# Altium schematic sheet inputs.SchDoc
size B; SheetNumber: 2; SheetTotal: 3
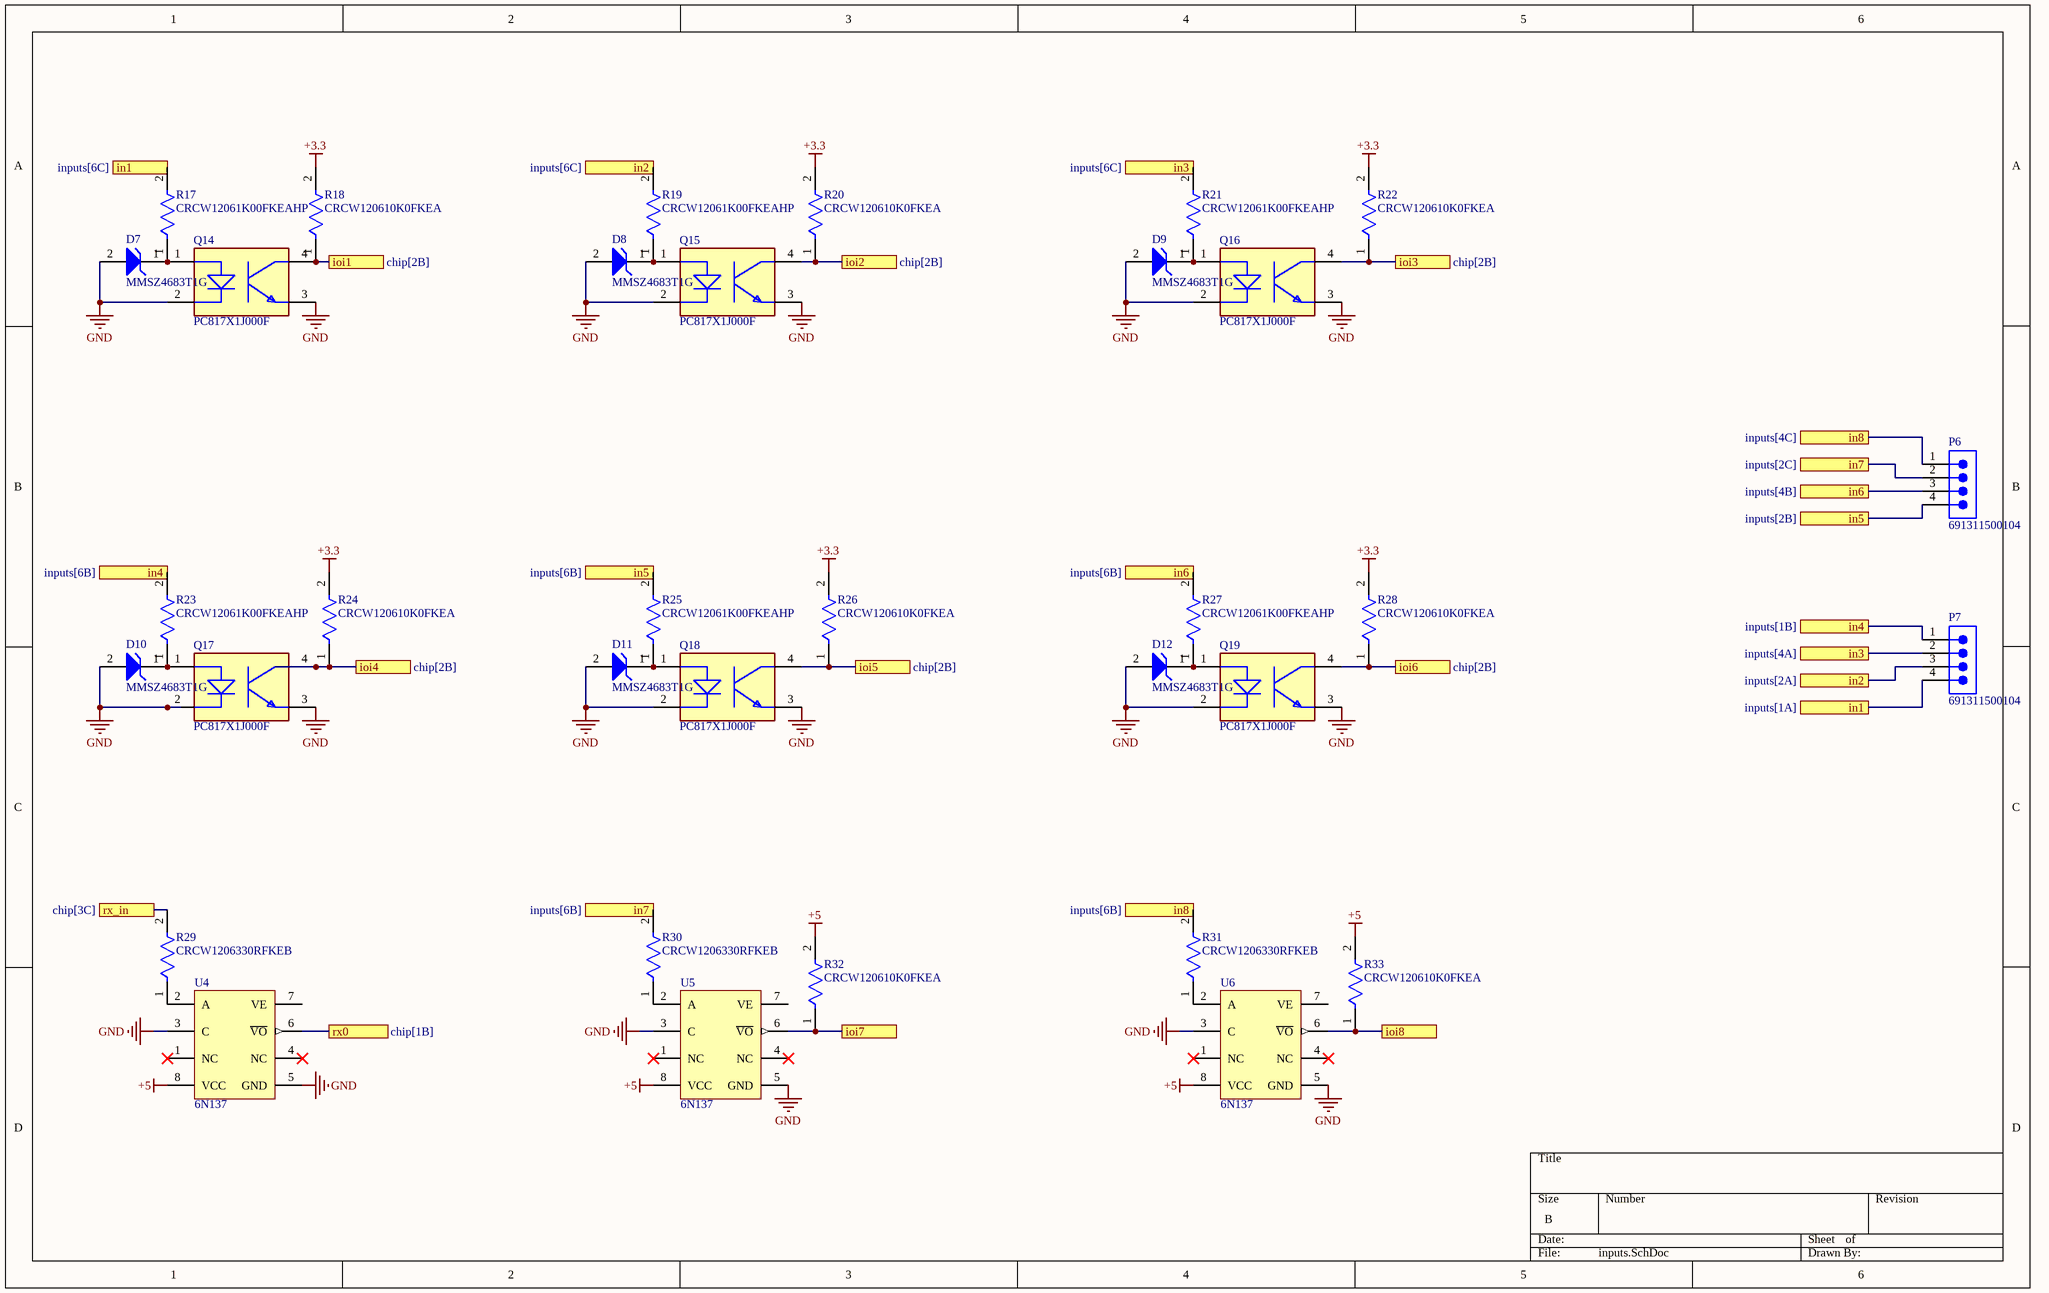
[diagram p0: inputs.SchDoc]

## Parts
D7  MMSZ4683T1G  [ONSC-SOD-123-2-425-04_V]
D8  MMSZ4683T1G  [ONSC-SOD-123-2-425-04_V]
D9  MMSZ4683T1G  [ONSC-SOD-123-2-425-04_V]
D10  MMSZ4683T1G  [ONSC-SOD-123-2-425-04_V]
D11  MMSZ4683T1G  [ONSC-SOD-123-2-425-04_V]
D12  MMSZ4683T1G  [ONSC-SOD-123-2-425-04_V]
P6  691311500104  [691311500104]
P7  691311500104  [691311500104]
Q14  PC817X1J000F  [FP-PC817X1J000F-MFG]
Q15  PC817X1J000F  [FP-PC817X1J000F-MFG]
Q16  PC817X1J000F  [FP-PC817X1J000F-MFG]
Q17  PC817X1J000F  [FP-PC817X1J000F-MFG]
Q18  PC817X1J000F  [FP-PC817X1J000F-MFG]
Q19  PC817X1J000F  [FP-PC817X1J000F-MFG]
R17  CRCW12061K00FKEAHP  [FP-CRCW1206-HPe3-MFG]
R18  CRCW120610K0FKEA  [FP-CRCW1206-e3-IPC_C]
R19  CRCW12061K00FKEAHP  [FP-CRCW1206-HPe3-MFG]
R20  CRCW120610K0FKEA  [FP-CRCW1206-e3-IPC_C]
R21  CRCW12061K00FKEAHP  [FP-CRCW1206-HPe3-MFG]
R22  CRCW120610K0FKEA  [FP-CRCW1206-e3-IPC_C]
R23  CRCW12061K00FKEAHP  [FP-CRCW1206-HPe3-MFG]
R24  CRCW120610K0FKEA  [FP-CRCW1206-e3-IPC_C]
R25  CRCW12061K00FKEAHP  [FP-CRCW1206-HPe3-MFG]
R26  CRCW120610K0FKEA  [FP-CRCW1206-e3-IPC_C]
R27  CRCW12061K00FKEAHP  [FP-CRCW1206-HPe3-MFG]
R28  CRCW120610K0FKEA  [FP-CRCW1206-e3-IPC_C]
R29  CRCW1206330RFKEB  [FP-CRCW1206-e3-IPC_A]
R30  CRCW1206330RFKEB  [FP-CRCW1206-e3-IPC_A]
R31  CRCW1206330RFKEB  [FP-CRCW1206-e3-IPC_A]
R32  CRCW120610K0FKEA  [FP-CRCW1206-e3-IPC_C]
R33  CRCW120610K0FKEA  [FP-CRCW1206-e3-IPC_C]
U4  6N137  [VISH-DIP-8_A]
U5  6N137  [VISH-DIP-8_A]
U6  6N137  [VISH-DIP-8_A]

## Ports
in1 (see inputs[1A]), in1 (see inputs[6C]), in2 (see inputs[2A]), in2 (see inputs[6C]), in3 (see inputs[4A]), in3 (see inputs[6C]), in4 (see inputs[1B]), in4 (see inputs[6B]), in5 (see inputs[2B]), in5 (see inputs[6B]), in6 (see inputs[4B]), in6 (see inputs[6B]), in7 (see inputs[2C]), in7 (see inputs[6B]), in8 (see inputs[4C]), in8 (see inputs[6B]), ioi1 (see chip[2B]), ioi2 (see chip[2B]), ioi3 (see chip[2B]), ioi4 (see chip[2B]), ioi5 (see chip[2B]), ioi6 (see chip[2B]), ioi7, ioi8, rx0 (see chip[1B]), rx_in (see chip[3C])

## Nets
+3.3: R18.2 R20.2 R22.2 R24.2 R26.2 R28.2
+5: R32.2 R33.2 U4.8(VCC) U5.8(VCC) U6.8(VCC)
GND: D7.2(A) D8.2(A) D9.2(A) D10.2(A) D11.2(A) D12.2(A) Q14.2(C) Q14.3(E) Q15.2(C) Q15.3(E) Q16.2(C) Q16.3(E) Q17.2(C) Q17.3(E) Q18.2(C) Q18.3(E) Q19.2(C) Q19.3(E) U4.3(C) U4.5(GND) U5.3(C) U5.5(GND) U6.3(C) U6.5(GND)
in1: P7.4 R17.2 ; port in1
in2: P7.3 R19.2 ; port in2
in3: P7.2 R21.2 ; port in3
in4: P7.1 R23.2 ; port in4
in5: P6.4 R25.2 ; port in5
in6: P6.3 R27.2 ; port in6
in7: P6.2 R30.2 ; port in7
in8: P6.1 R31.2 ; port in8
ioi1: Q14.4(C) R18.1 ; port ioi1
ioi2: Q15.4(C) R20.1 ; port ioi2
ioi3: Q16.4(C) R22.1 ; port ioi3
ioi4: Q17.4(C) R24.1 ; port ioi4
ioi5: Q18.4(C) R26.1 ; port ioi5
ioi6: Q19.4(C) R28.1 ; port ioi6
ioi7: R32.1 U5.6(~{VO}) ; port ioi7
ioi8: R33.1 U6.6(~{VO}) ; port ioi8
rx0: U4.6(~{VO}) ; port rx0
rx_in: R29.2 ; port rx_in
NetD7_1: D7.1(K) Q14.1(A) R17.1
NetD8_1: D8.1(K) Q15.1(A) R19.1
NetD9_1: D9.1(K) Q16.1(A) R21.1
NetD10_1: D10.1(K) Q17.1(A) R23.1
NetD11_1: D11.1(K) Q18.1(A) R25.1
NetD12_1: D12.1(K) Q19.1(A) R27.1
NetR29_1: R29.1 U4.2(A)
NetR30_1: R30.1 U5.2(A)
NetR31_1: R31.1 U6.2(A)

Not connected (* = marked no-connect by the designer): U4 1(NC)* 4(NC)* 7(VE); U5 1(NC)* 4(NC)* 7(VE); U6 1(NC)* 4(NC)* 7(VE)

## Library data of the parts
D7-D12 = CMP-1060-00600-1: Zener Voltage Regulator, 500 mW, 2-Pin SOD-123, Pb-Free, Tape and Reel; Manufacturer: On Semiconductor; P Max (W): 0.5; VZ Typ (V): 3; ComponentLink2Description: Datasheet; ComponentLink3URL: http://www.onsemi.com/pub_link/Collateral/425-04.PDF; PackageVersion: Rev. G, 10/2009; RoHS: Pb-Free; ComponentLink2URL: http://www.onsemi.com/pub_link/Collateral/MMSZ4678T1-D.PDF; DatasheetVersion: Rev. 9; PackageDescription: 2-Pin SOD, Body 1.6 x 2.69 mm; PartNumber: MMSZ4683T1G; ComponentLink3Description: Package Specification; ComponentLink1URL: http://www.onsemi.com/; ComponentLink1Description: Manufacturer URL; Packing: Tape and Reel; PackageReference: SOD-123-2-425-04; Mounting Technology: Surface Mount
P6 P7 = CMP-1502-02148-2: NexarPartId: 8917749; Pitch: 5.08mm; Number of Positions Per Level: 4; Gender: Male; Voltage: 300V; Current: 20A; Number of Levels: 1; Orientation: Vertical; Number of Pins: 4; Mount: Through Hole; Number of Contacts: 4; Length: 8.5mm; Number of Rows: 1; Contact Plating: Tin; Color: Green; Termination: Solder; Contact Material: Brass; REACH SVHC: Unknown; RoHS: Compliant; Lead Pitch: 5.08mm; Width: 22.32mm; Height: 12mm; Packaging: Box
Q14-Q19 = CMP-65434-000003-1: OPTOISOLATOR 5KV TRANS 4DIP; Collector Emitter Saturation Voltage: 200mV; Forward Voltage: 1.4V; Power Dissipation: 200mW; Input Current: 20mA; Max Collector Current: 50mA; Collector Emitter Breakdown Voltage: 80V; Rise Time: 18000ns; Number of Elements: 1; Reverse Breakdown Voltage: 6V; Current Transfer Ratio: 600%; Min Operating Temperature: -30°C; Number of Pins: 4; Radiation Hardening: No; Output Current per Channel: 50mA; Case/Package: DIP; Fall Time: 18000ns; Forward Current: 50mA; Isolation Voltage: 5kV; Package Quantity: 2000; Max Operating Temperature: 100°C; Packaging: Sleeve; Max Input Current: 50mA; Output Voltage: 80V; Max Power Dissipation: 200mW; Mount: Through Hole; Number of Channels: 1; Collector Emitter Voltage (VCEO): 80V
R17 R19 R21 R23 R25 R27 = CMP-2003-04874-2: RES SMD 1K OHM 1% 3/4W 1206; Manufacturer: Vishay; Automotive Grade: Grade 0; Resistance: 1kΩ; Power Rating: 0.75W; Temperature Coefficient: 100ppm/°C; Value: 1kΩ; Voltage Rating: 200V; Category: Res; Tolerance: 1%; Manufacturer Part Number: CRCW12061K00FKEAHP; Mouser Description: Res Thick Film 1206 1K Ohm 1% 0.75W ±100ppm/°C Molded SMD SMD Paper T/R; Octopart: https://octopart.com/crcw12061k00fkeahp-vishay-42635114; Package: CRCW1206-HPe3; Device Class L1: Passive Components; Ipc Land Pattern Name: RESC310160X50; Temperature Range High: +155°C; Lead Free: Yes; Device Class L2: Resistors; RoHS: TRUE; Temperature: -55°C to +155°C; Composition: Thick Film; Height: 0.65mm; Automotive: Yes; ComponentLink2Description: Datasheet; Digikey Description: RES SMD 1K OHM 1% 3/4W 1206; ComponentLink2URL: http://www.vishay.com/docs/20043/crcwhpe3.pdf; Device Class L3: Chip SMD Resistors; Series: CRCW-HP e3; Temperature Range Low: -55°C
R18 R20 R22 R24 R26 R28 R32 R33 = CMP-2003-04807-2: RES Thick Film, 10kΩ, 1%, 0.25W, 100ppm/°C, 1206; Working Voltage: 200V; Max Power Dissipation: 250mW; Resistance: 10kR; Tolerance: 1%; Width: 0.063inch; Height: 0.55mm; Number of Pins: 2; Voltage Rating: 200V; Temperature Coefficient: 100ppm/°C; Military Standard: Not; Features: Automotive AEC-Q200; Depth: 1.6mm; Radiation Hardening: No; Termination: SMD/SMT; Case Code (Imperial): 1206; Weight: 0.000353oz; Length: 3.2mm; Package Quantity: 10; Voltage Rating (DC): 200V; Case/Package: 1206; Min Operating Temperature: -55°C; Number of Terminations: 2; Composition: Thick Film; Contact Plating: Tin; Power Rating: 250mW; Packaging: Tape and Reel; Max Operating Temperature: 155°C; Lead Free: Lead Free; Case Code (Metric): 3216
R29-R31 = CMP-02407-010853-1: RES Thick Film, 330Ω, 1%, 0.25W, 100ppm/°C, 1206; Resistance: 330R; Power Rating: 250mW; Voltage Rating: 200V; Package Quantity: 10000; Width: 0.063inch; Length: 0.126inch; Case/Package: 1206; Lead Free: Lead Free; Max Operating Temperature: 155°C; Height: 0.024inch; Case Code (Imperial): 1206; Weight: 0.000353oz; Max Power Dissipation: 250mW; Packaging: Tape and Reel; Case Code (Metric): 3216; Number of Terminations: 2; Min Operating Temperature: -55°C; Features: Automotive AEC-Q200; Tolerance: 1%; Composition: Thick Film; Temperature Coefficient: 100ppm/°C
U4-U6 = CMP-2000-05669-1: High Speed Optocoupler, Single and Dual, 10 MBd, 5 V, -40 to 100 degC, 8-Pin DIP, RoHS, Tube; Manufacturer: Vishay; No. of Channels: 1Channel; Isolation Voltage: 5.3kV; Data Rate: 10Mbaud; SVHC: ToBeAdvised; No. of Pins: 8Pins; Package Description: 8-Pin Double In-line Package, Body 10.16 x 6.7 mm, Pitch 2.54 mm; Manufacturer URL: http://www.vishay.com/; Product Range: -; Optocoupler Case Style: DIP; Mounting Technology: ThroughHole; Packaging: Each; Package Reference: DIP-8; Datasheet Version: Rev. 1.9, 03/2015; Datasheet URL: http://www.vishay.com/docs/84732/6n137.pdf